# Altium project OLED.PrjPcb
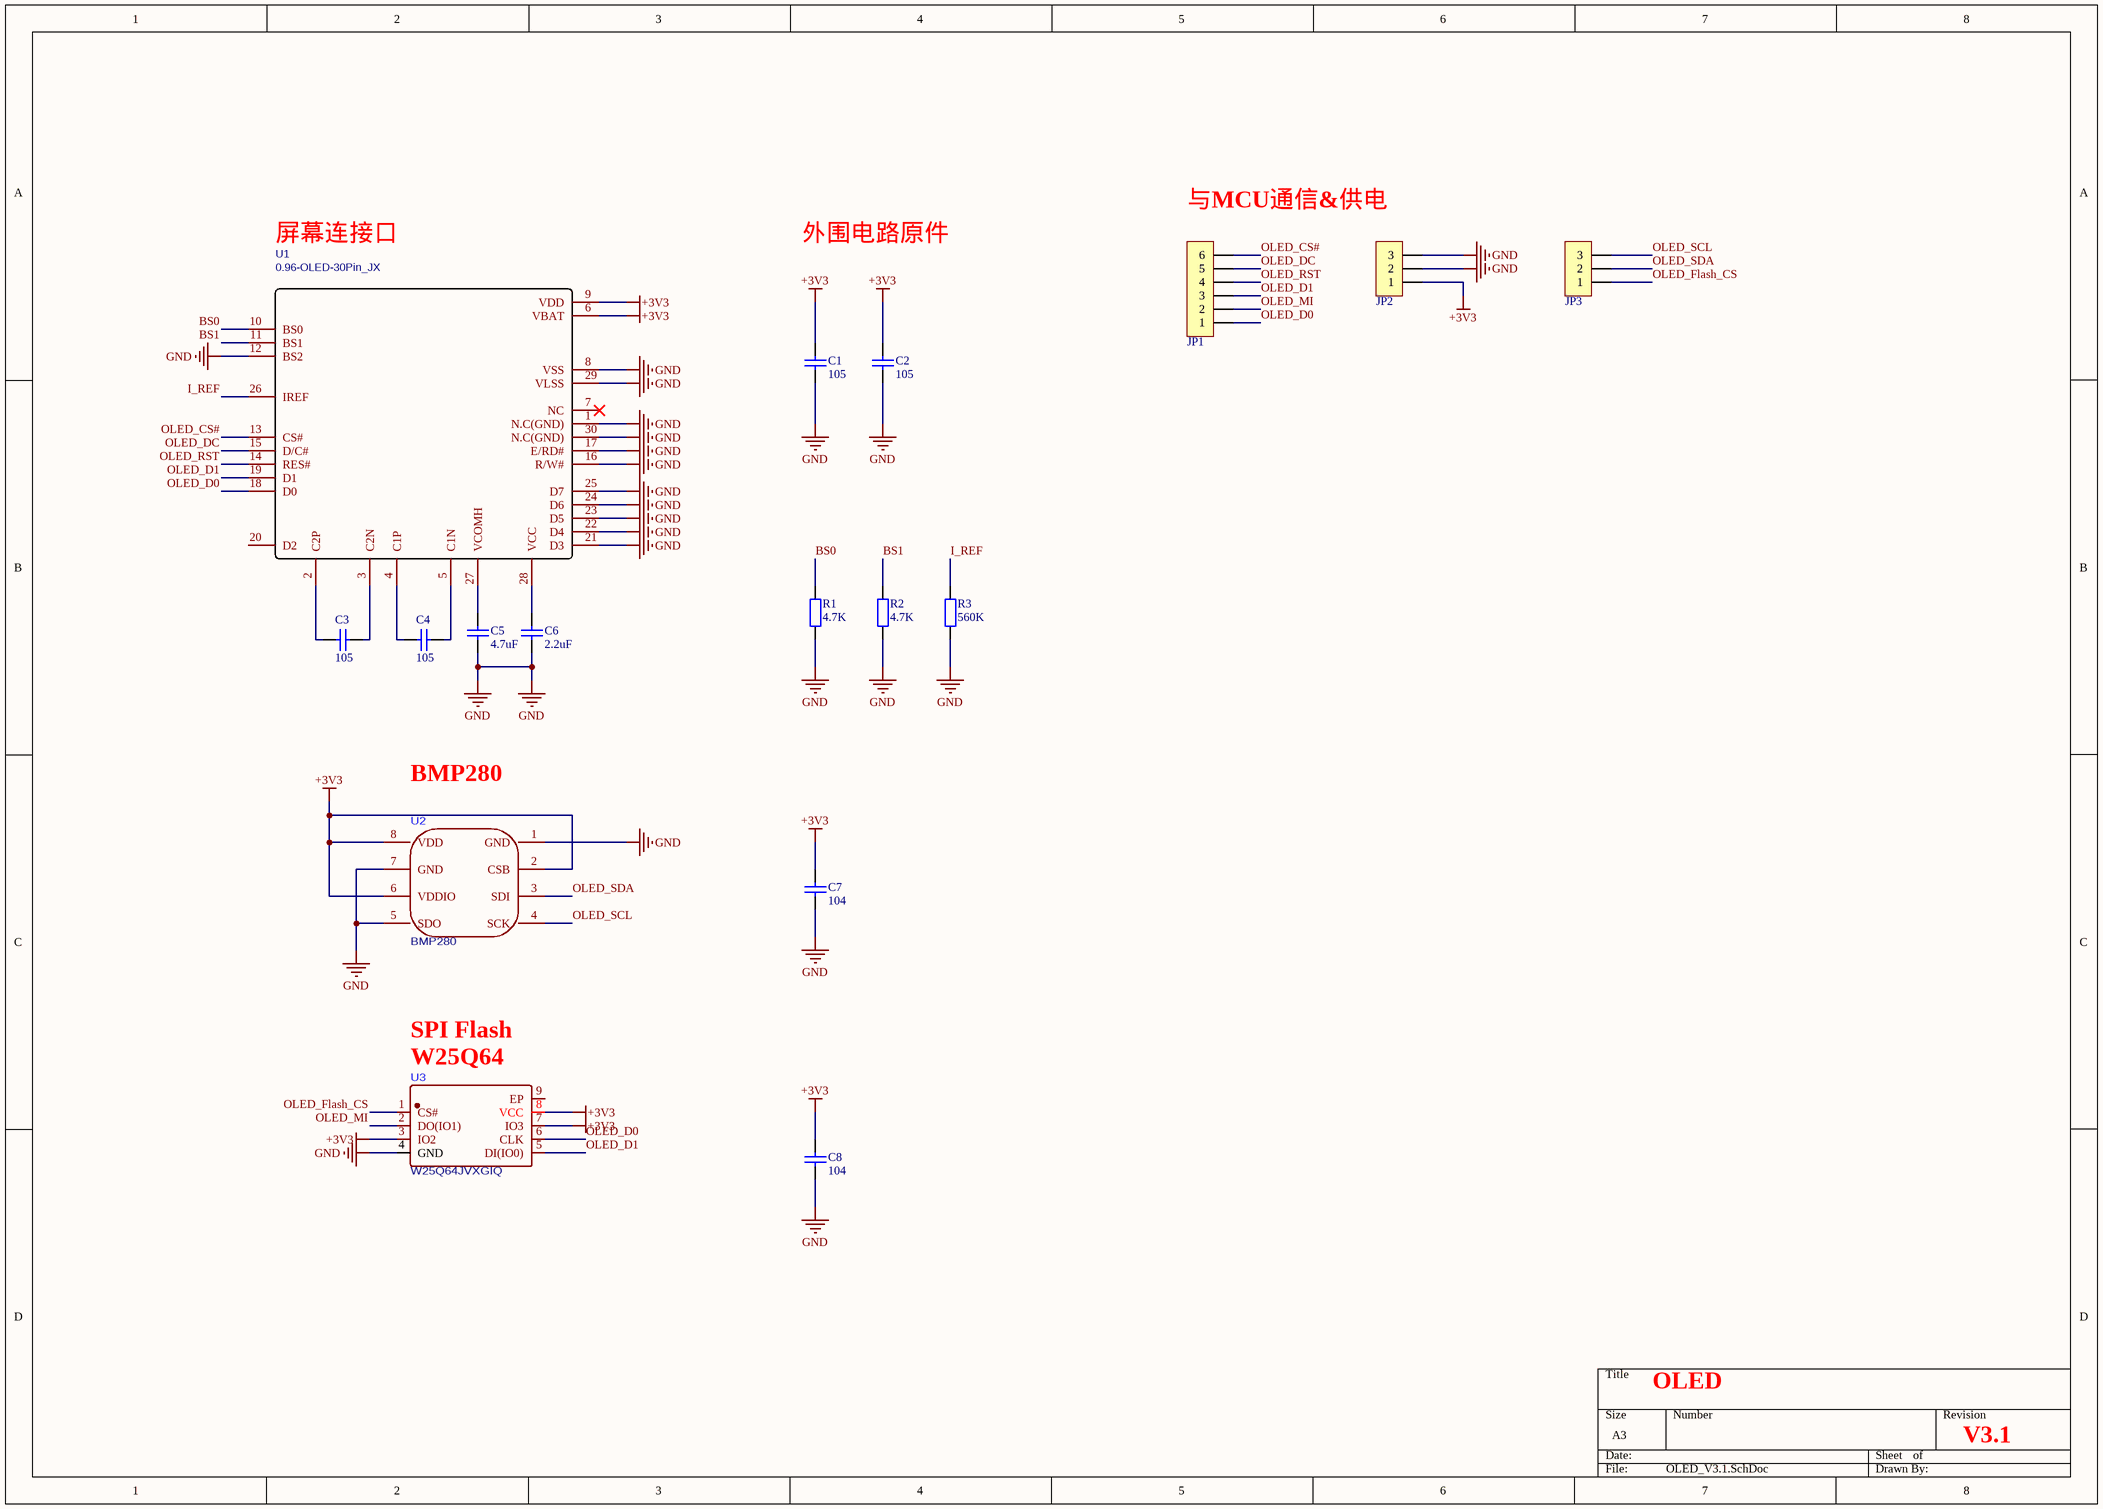
[diagram p0: OLED_V3.1.SchDoc]
1 sheet, 17 parts. Net scope: global (net labels, ports and power ports of the same name join across sheets).
Board file: OLED_V3.1.PcbDoc

## Sheet OLED_V3.1.SchDoc
size A3

### Parts
C1  105  [C0603_M]
C2  105  [C0603_M]
C3  105  [C0603_M]
C4  105  [C0603_M]
C5  4.7uF  [C0603_M]
C6  2.2uF  [C0603_M]
C7  104  [C0603_M]
C8  104  [C0603_M]
JP1  HDR-1X6  [HDR-1X6]  (value not drawn)
JP2  HDR-1X3  [OLED_3PIN]  (value not drawn)
JP3  HDR-1X3  [OLED_3PIN]  (value not drawn)
R1  4.7K  [R0603_M]
R2  4.7K  [R0603_M]
R3  560K  [R0603_M]
U1  0.96-OLED-30Pin_JX  [SSD1306-30PIN_JX]
U2  BMP280  [LGA-8_L2.5-W2.0-P0.65_AMP6127]
U3  W25Q64JVXGIQ  [XSON-8_L4.0-W4.0-P0.80-TL-EP]

### Nets
+3V3: C1.2 C2.2 C7.2 C8.2 JP2.1 U1.6(VBAT) U1.9(VDD) U2.2(CSB) U2.6(VDDIO) U2.8(VDD) U3.3(IO2) U3.7(IO3) U3.8(VCC)
GND: C1.1 C2.1 C5.1 C6.1 C7.1 C8.1 JP2.2 JP2.3 R1.1 R2.1 R3.1 U1.1(N.C(GND)) U1.8(VSS) U1.12(BS2) U1.16(R/W#) U1.17(E/RD#) U1.21(D3) U1.22(D4) U1.23(D5) U1.24(D6) U1.25(D7) U1.29(VLSS) U1.30(N.C(GND)) U2.1(GND) U2.5(SDO) U2.7(GND) U3.4(GND)
BS0: R1.2 U1.10(BS0)
BS1: R2.2 U1.11(BS1)
I_REF: R3.2 U1.26(IREF)
OLED_CS#: JP1.6 U1.13(CS#)
OLED_D0: JP1.1 U1.18(D0) U3.6(CLK)
OLED_D1: JP1.3 U1.19(D1) U3.5(DI(IO0))
OLED_DC: JP1.5 U1.15(D/C#)
OLED_Flash_CS: JP3.1 U3.1(CS#)
OLED_MI: JP1.2 U3.2(DO(IO1))
OLED_RST: JP1.4 U1.14(RES#)
OLED_SCL: JP3.3 U2.4(SCK)
OLED_SDA: JP3.2 U2.3(SDI)
NetC3_1: C3.1 U1.3(C2N)
NetC3_2: C3.2 U1.2(C2P)
NetC4_1: C4.1 U1.5(C1N)
NetC4_2: C4.2 U1.4(C1P)
NetC5_2: C5.2 U1.27(VCOMH)
NetC6_2: C6.2 U1.28(VCC)

Not connected (* = marked no-connect by the designer): U1 7(NC)* 20(D2); U3 9(EP)

### Notes on the sheet
- 屏幕连接口
- 外围电路原件
- (near JP1) 与MCU通信&供电
- BMP280
- SPI Flash
- (near U3) W25Q64
- OLED
- V3.1

### Library data of the parts
C1-C8 = C: 贴片电容/MLCC电容; BOM名称: 无极性贴片电容; 当前库版本V2022.11.14 @淘宝卖家:黄晶宝石: 最新版本发布https://shop463601444.taobao.com
JP1 = Header 6: 6P接插件; 版权归属: 黎明电子style; BOM名称: 6P接插件; 学习资源: https://lmdzstyle.taobao.com/
JP2 JP3 = Header 3: 3P接插件; 版权归属: 黎明电子style; BOM名称: 3P接插件; 学习资源: https://lmdzstyle.taobao.com/
R1-R3 = R: 贴片电阻; 联系下单店铺卖家 免费帮你查找封装: 联系下单店铺卖家 免费技术支持; BOM名称: 贴片电阻
U1 = 0.96-OLED-30Pin_JX: spicePre: U; BOM_Supplier: LCSC